# EAGLE schematic projekt MIKRO (EAGLE 9.6.2)
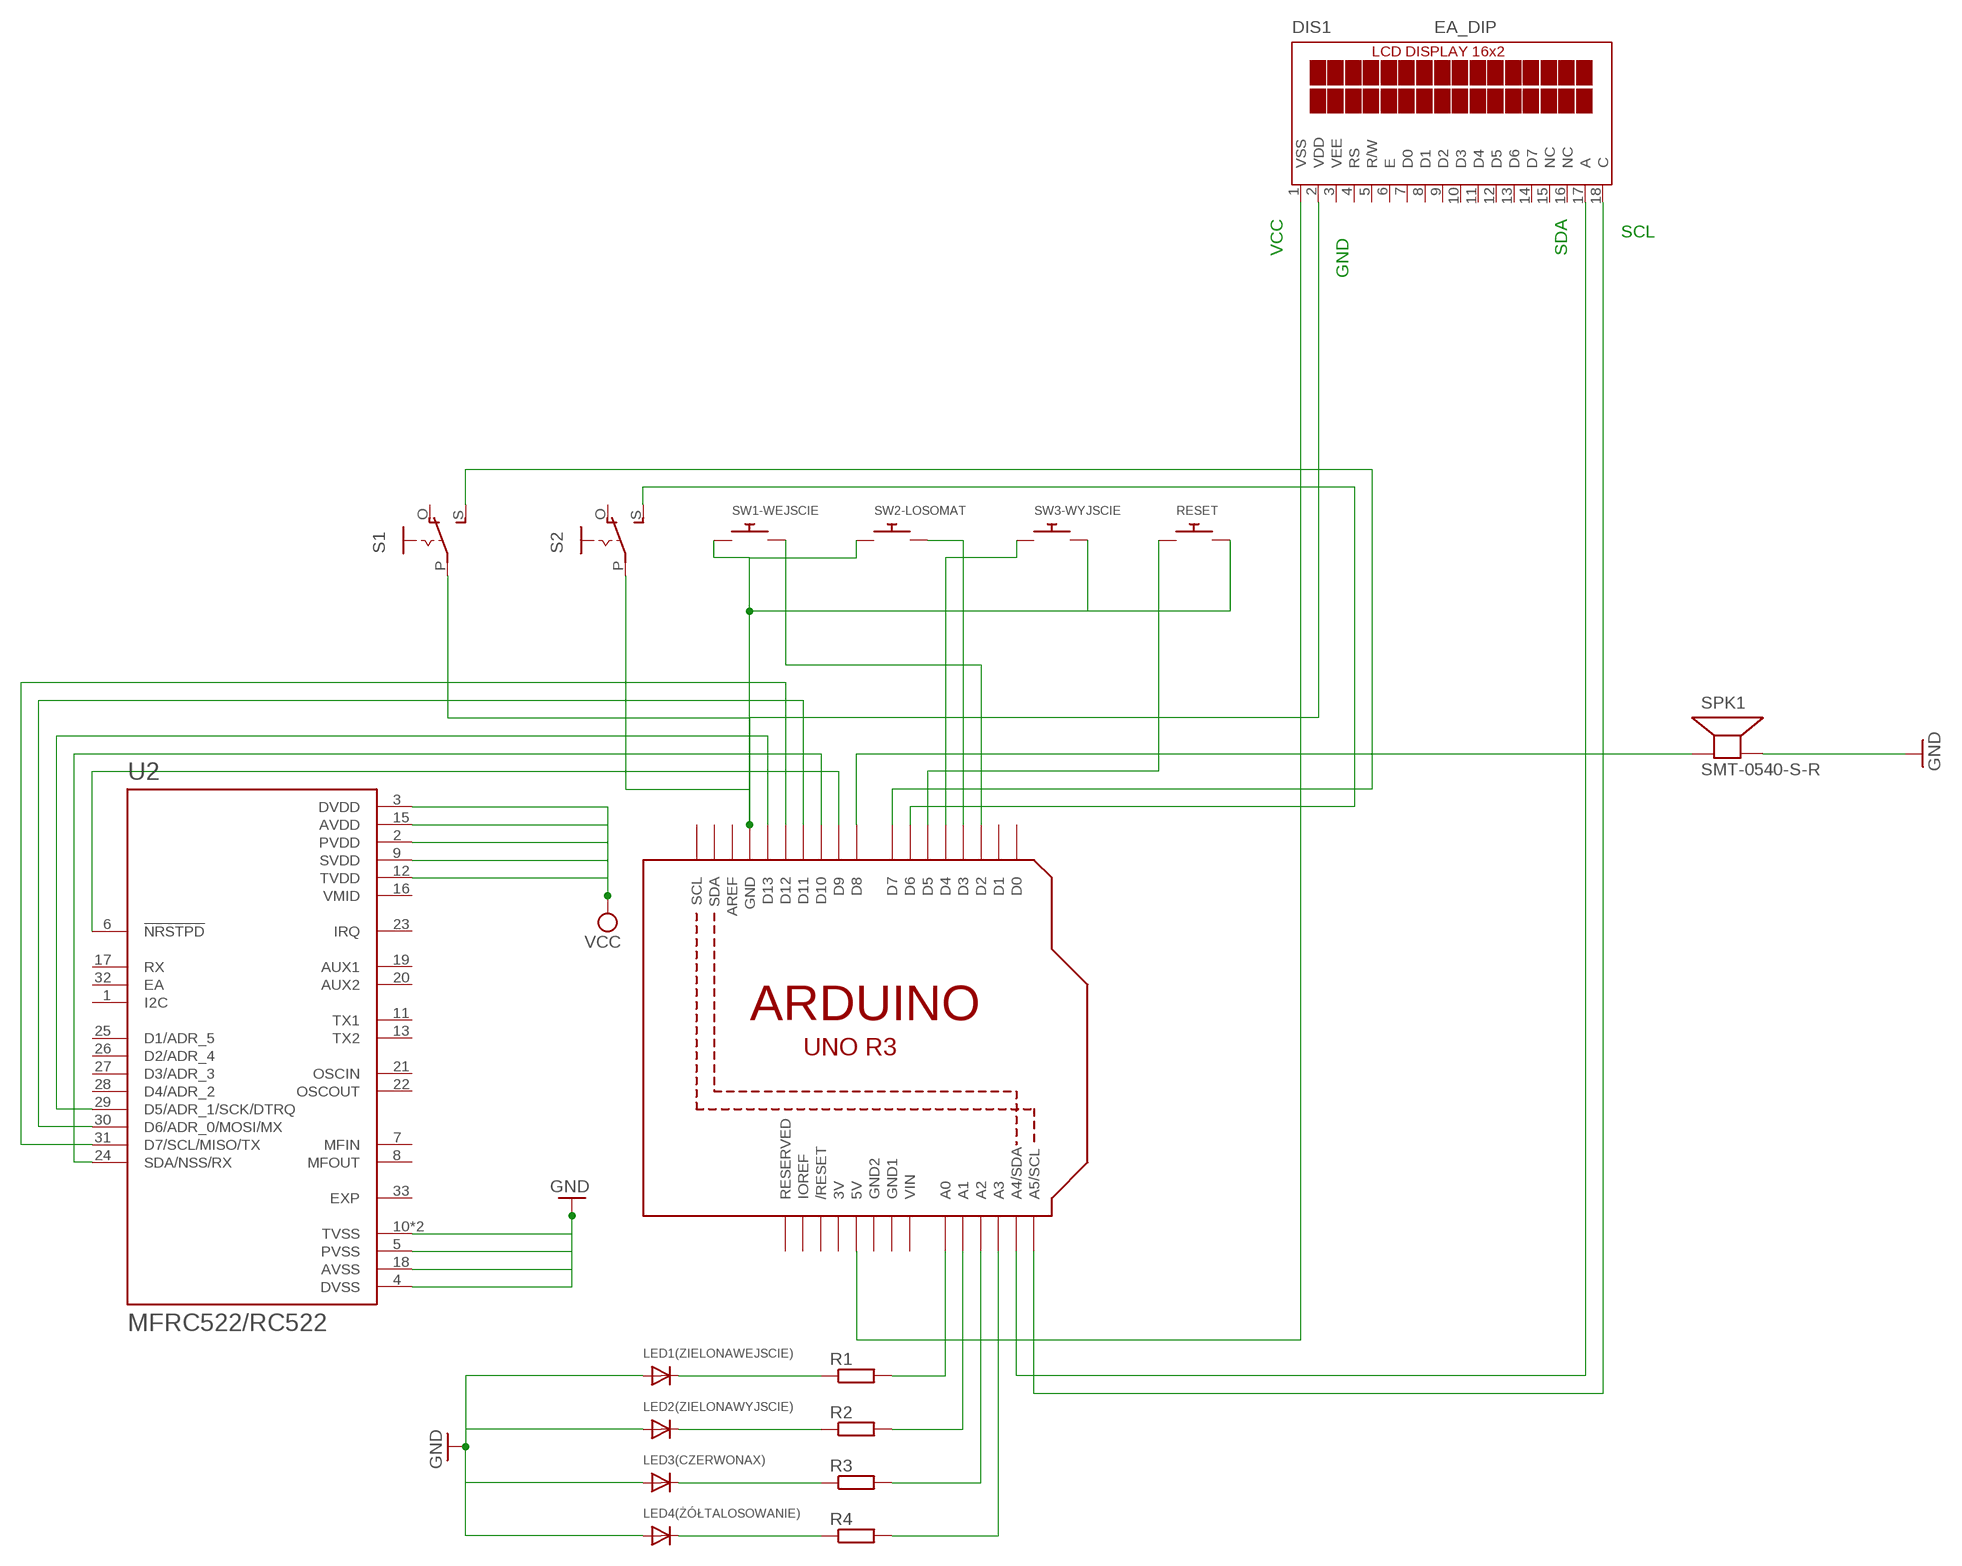
[diagram p0: schematic, sheet 1]

## Parts
DIS1  EA_DIP  [EA_DIP]
LED1(ZIELONAWEJSCIE)  DIODEDO-1N4148  [DO-1N4148]
LED2(ZIELONAWYJSCIE)  DIODEDO-1N4148  [DO-1N4148]
LED3(CZERWONAX)  DIODEDO-1N4148  [DO-1N4148]
LED4(ŻÓŁTALOSOWANIE)  DIODEDO-1N4148  [DO-1N4148]
R1  R-EU_VMTB60  [VMTB60]
R2  R-EU_VMTB60  [VMTB60]
R3  R-EU_VMTB60  [VMTB60]
R4  R-EU_VMTB60  [VMTB60]
RESET  SWITCH_PUSHBUTTONEVQ-PE  [TACT_PANA-EVQ]
S1  EG1218S  [EG1218]
S2  EG1218S  [EG1218]
SPK1  SMT-0540-S-R  [SMT-0540-S-R]
SW1-WEJSCIE  SWITCH_PUSHBUTTONEVQ-PE  [TACT_PANA-EVQ]
SW2-LOSOMAT  SWITCH_PUSHBUTTONEVQ-PE  [TACT_PANA-EVQ]
SW3-WYJSCIE  SWITCH_PUSHBUTTONEVQ-PE  [TACT_PANA-EVQ]
U1  ARDUINOR3-DIMENSION  [ARDUINOR3]
U2  MFRC522/RC522  [QFN50P500X500X100-33N]

## Nets
GND: LED1(ZIELONAWEJSCIE).A LED2(ZIELONAWYJSCIE).A LED3(CZERWONAX).A LED4(ŻÓŁTALOSOWANIE).A SPK1.+(-) U2.4(DVSS) U2.5(PVSS) U2.10(TVSS) U2.14(TVSS) U2.18(AVSS)
N$1: DIS1.1(VSS) U1.5V
N$2: DIS1.2(VDD) RESET.P$2 S1.P S2.P SW1-WEJSCIE.P$1 SW2-LOSOMAT.P$1 SW3-WYJSCIE.P$2 U1.GND
N$3: DIS1.17(A) U1.A4(A4/SDA)
N$4: DIS1.18(C) U1.A5(A5/SCL)
N$5: U1.D10 U2.24(SDA/NSS/RX)
N$6: U1.D13 U2.29(D5/ADR_1/SCK/DTRQ)
N$7: U1.D11 U2.30(D6/ADR_0/MOSI/MX)
N$8: U1.D12 U2.31(D7/SCL/MISO/TX)
N$9: U1.D9 U2.6(!NRSTPD)
N$10: SW1-WEJSCIE.P$2 U1.D2
N$11: SW2-LOSOMAT.P$2 U1.D3
N$12: SW3-WYJSCIE.P$1 U1.D4
N$13: RESET.P$1 U1.D5
N$14: S2.S U1.D6
N$15: S1.S U1.D7
N$16: LED1(ZIELONAWEJSCIE).C R1.1
N$17: LED2(ZIELONAWYJSCIE).C R2.1
N$18: LED3(CZERWONAX).C R3.1
N$19: LED4(ŻÓŁTALOSOWANIE).C R4.1
N$20: R1.2 U1.A0
N$21: R2.2 U1.A1
N$22: R3.2 U1.A2
N$23: R4.2 U1.A3
N$24: SPK1.-(+) U1.D8
VCC: U2.2(PVDD) U2.3(DVDD) U2.9(SVDD) U2.12(TVDD) U2.15(AVDD)
Unconnected: DIS1.4(RS) DIS1.5(R/W) DIS1.6(E) DIS1.7(D0) DIS1.8(D1) DIS1.9(D2) DIS1.10(D3) DIS1.11(D4) DIS1.12(D5) DIS1.13(D6) DIS1.14(D7) DIS1.15(NC) DIS1.16(NC) S1.O S2.O U1.AREF U1.D0 U1.D1 U1.IOREF U1.RESERVED U1.RESET(/RESET) U1.SCL U1.SDA U2.1(I2C) U2.7(MFIN) U2.8(MFOUT) U2.11(TX1) U2.13(TX2) U2.17(RX) U2.19(AUX1) U2.20(AUX2) U2.21(OSCIN) U2.22(OSCOUT) U2.23(IRQ) U2.25(D1/ADR_5) U2.26(D2/ADR_4) U2.27(D3/ADR_3) U2.28(D4/ADR_2) U2.32(EA) U2.33(EXP)

## Notes on the sheet
- GND | SCL
- VCC | SDA

## Power pins joined to a net without a drawn wire
3V: U1.3V
GND1: U1.GND1
GND2: U1.GND2
VEE: DIS1.3(VEE)
VIN: U1.VIN
VMID: U2.16(VMID)

## Library data of the parts
DIS1 = display-lcd:EA_DIP: LCD-MODUL 2x16 - 6,68mm, INKL. KONTROLLER HD44780 Source: Data sheet <http://www.lcd-module.de/pdf/doma/dip162-d.pdf>
LED1(ZIELONAWEJSCIE) LED2(ZIELONAWYJSCIE) LED3(CZERWONAX) LED4(ŻÓŁTALOSOWANIE) = adafruit:DIODE: Diode SMADIODE - SMA Surface Mount Package 20V 1A Schottky Diode Digikey: 641-1014-6-ND DO-1N4148 - Through Hole Small Current Diode SOD-123 20V 1 A (.5mV Vf) Schottky Diode - Digikey: MBRX120TPMSCT-ND SOD-323 10V 570mA (.38mV Vf, 3ns) Schottky Diode - Digikey: ZLLS410CT-ND SOD-523 30V 30mA Schottky Diode (RB751S-40TE61) - Digikey: RB751S-40TE61CT-ND SOT23-R/W - SOT23 Package (R = Solder Paste/Reflow Ovens, W = Hand-Soldering) BAT54Film 40V 300mA - Digikey: 497-7162-1-ND
R1-R4 = rcl:R-EU_: RESISTOR, European symbol; SPICEPREFIX: R
RESET SW1-WEJSCIE SW2-LOSOMAT SW3-WYJSCIE = adafruit:SWITCH_PUSHBUTTON: Buttons SOFTTOUCHSMD_SJ - Soft touch temporary push button (Super Junk Akihabara) Compatible with SKPMANE010 [Mouser: 688-SKPMAN] C&K_KSS = Digikey: KSS221GLFS
S1 S2 = adafruit:EG1218: SLIDING SWITCH 0.1" spacing through hole, vertical SPDT slide switch http://www.ladyada.net/library/pcb/eaglelibrary.html
SPK1 = adafruit:SMT-0540-S-R: SMT-0549-S-R Small surface-mount magnetic buzzer
U1 = adafruit:ARDUINOR3: This is a new object for the new Arduino R3 - with extra pins that you may want to use (such as IOref, and duplicated A4/A5
U2 = MFRC522_RC522:MFRC522/RC522: Check availability <https://pricing.snapeda.com/parts/MFRC522/RC522/NXP%20Semiconductors/view-part?ref=eda>; AVAILABILITY: Not in stock; CHECK_PRICES: https://www.snapeda.com/parts/MFRC522/RC522/NXP+Semiconductors/view-part/?ref=eda; MF: NXP Semiconductors; MP: MFRC522/RC522; PACKAGE: VFQFN-32 NXP Semiconductors; PRICE: None; SNAPEDA_LINK: https://www.snapeda.com/parts/MFRC522/RC522/NXP+Semiconductors/view-part/?ref=snap